# EasyEDA Pro project ProPrj_CyMouse.epro, schematic 无线充电接收端
Board Name: 无线充电接收端; Create Date: 2025-08-29; Page Name: P1; Project Name: CyMouse; Schematic Name: 无线充电接收端; Update Date: 2025-08-29; Company: 嘉立创EDA; Page Size: A4; Version: V1.0
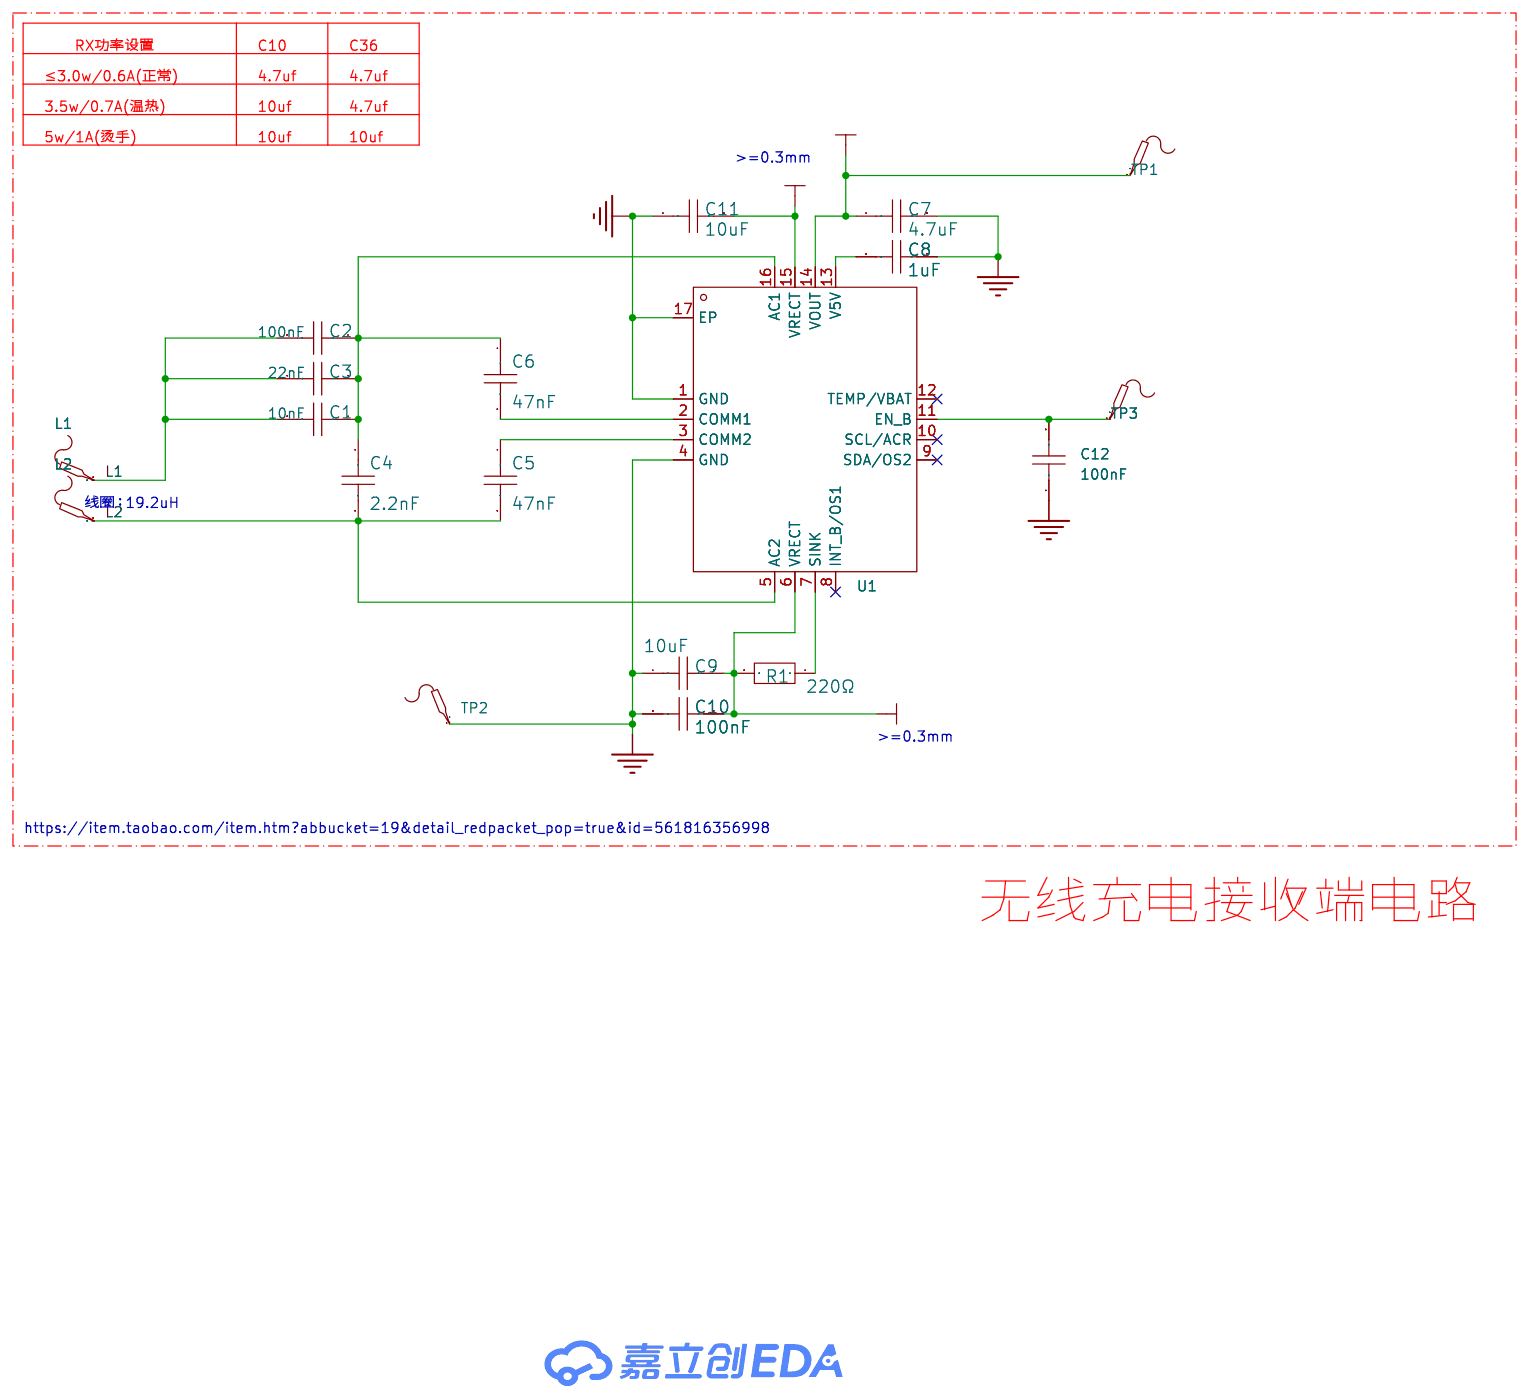
[diagram p2: schematic sheet]

## Parts
C1  10nF  [C0603]
C2  100nF  [C0603]
C3  22nF  [C0603]
C4  2.2nF  [C0603]
C5  47nF  [C0603]
C6  47nF  [C0603]
C7  4.7uF  [C0603]
C8  1uF  [C0603]
C9  10uF  [C0603]
C10  100nF  [C0603]
C11  10uF  [C0603]
C12  100nF  [C0603]
L1  -  [Test-Point-0.5mm]
L2  -  [Test-Point-0.5mm]
R1  220Ω  [R0603]
TP1  -  [Test-Point-0.5mm]
TP2  -  [Test-Point-0.5mm]
TP3  -  [Test-Point-0.5mm]
U1  NU1680  [QFN-16_L3.0-W3.0-P0.50-TL-EP1.9]

## Library data of the parts
C1 = CC0603KRX7R9BB103: 容值:10nF;精度:±10%;额定电压:50V;材质(温度系数):X7R;; LCSC Part Name: 10nF ±10% 50V; Supplier Part: C100042; Manufacturer: YAGEO(国巨); Supplier Footprint: 0603; JLCPCB Part Class: Extended Part; Datasheet: https://atta.szlcsc.com/upload/public/pdf/source/20181008/C309510_22F155564471FAF6A489F7D68F34234E.pdf; Supplier: LCSC; Tolerance: ±10%; Voltage Rated: 50V; Temperature Coefficient: X7R
C2 C10 C12 = CC0603JRX7R9BB104: 容值:100nF;精度:±5%;额定电压:50V;材质(温度系数):X7R;; LCSC Part Name: 100nF ±5% 50V; Supplier Part: C91183; Manufacturer: YAGEO(国巨); Supplier Footprint: 0603; JLCPCB Part Class: Extended Part; Datasheet: https://atta.szlcsc.com/upload/public/pdf/source/20170919/C131031_1505787245477976978.pdf; Supplier: LCSC; Tolerance: ±5%; Voltage Rated: 50V; Temperature Coefficient: X7R
C3 = CC0603JRX7R9BB223: 容值:22nF;精度:±5%;额定电压:50V;材质(温度系数):X7R;; LCSC Part Name: 22nF ±5% 50V; Supplier Part: C277528; Manufacturer: YAGEO(国巨); Supplier Footprint: 0603; JLCPCB Part Class: Extended Part; Datasheet: https://atta.szlcsc.com/upload/public/pdf/source/20181008/C309510_22F155564471FAF6A489F7D68F34234E.pdf; Supplier: LCSC; Tolerance: ±5%; Voltage Rated: 50V; Temperature Coefficient: X7R
C4 = CC0603JRNPO9BN222: 容值:2.2nF;精度:±5%;额定电压:50V;材质(温度系数):NP0;; LCSC Part Name: 2.2nF ±5% 50V; Supplier Part: C107043; Manufacturer: YAGEO(国巨); Supplier Footprint: 0603; JLCPCB Part Class: Extended Part; Datasheet: https://atta.szlcsc.com/upload/public/pdf/source/20170914/C128857_1505359892143968080.pdf; Supplier: LCSC; Tolerance: ±5%; Voltage Rated: 50V; Temperature Coefficient: NP0
C5 C6 = CC0603JRX7R9BB473: 容值:47nF;精度:±5%;额定电压:50V;材质(温度系数):X7R;; LCSC Part Name: 47nF ±5% 50V; Supplier Part: C519554; Manufacturer: YAGEO(国巨); Supplier Footprint: 0603; JLCPCB Part Class: Extended Part; Datasheet: https://atta.szlcsc.com/upload/public/pdf/source/20200423/C519554_A47B2077B76CCF5DDAED59412C429BD4.pdf; Supplier: LCSC; Tolerance: ±5%; Voltage Rated: 50V; Temperature Coefficient: X7R
C7 = CC0603KRX5R6BB475: 容值:4.7uF;精度:±10%;额定电压:10V;材质(温度系数):X5R;; LCSC Part Name: 4.7uF ±10% 10V; Supplier Part: C109456; Manufacturer: YAGEO(国巨); Supplier Footprint: 0603; JLCPCB Part Class: Extended Part; Datasheet: https://atta.szlcsc.com/upload/public/pdf/source/20180326/C109456_C871681ED5BBA6E2441ECA2A13136DA0.pdf; Supplier: LCSC; Tolerance: ±10%; Voltage Rated: 10V; Temperature Coefficient: X5R
C8 = CC0603JRX7R6BB105: 容值:1uF;精度:±5%;额定电压:10V;材质(温度系数):X7R;; LCSC Part Name: 1uF ±5% 10V; Supplier Part: C519559; Manufacturer: YAGEO(国巨); Supplier Footprint: 0603; JLCPCB Part Class: Extended Part; Datasheet: https://atta.szlcsc.com/upload/public/pdf/source/20200423/C519559_6C4B5FFAE74A7C54887BF5D296B4B550.pdf; Supplier: LCSC; Tolerance: ±5%; Voltage Rated: 10V; Temperature Coefficient: X7R
C9 C11 = CC0603KRX5R6BB106: 容值:10uF;精度:±10%;额定电压:10V;材质(温度系数):X5R;; LCSC Part Name: 10uF ±10% 10V; Supplier Part: C326057; Manufacturer: YAGEO(国巨); Supplier Footprint: 0603; JLCPCB Part Class: Extended Part; Datasheet: https://atta.szlcsc.com/upload/public/pdf/source/20181031/C326057_4190003E428C5A97DF6434D0EAB53BEA.pdf; Supplier: LCSC; Tolerance: ±10%; Voltage Rated: 10V; Temperature Coefficient: X5R
L1 L2 TP1-TP3 = Test-Point: Test Point 测试点
R1 = RC0603FR-07220RL: 电阻类型:厚膜电阻;阻值:220Ω;精度:±1%;功率:100mW;最大工作电压:75V;温度系数:±100ppm/℃;; LCSC Part Name: 厚膜电阻 220Ω ±1% 100mW; Supplier Part: C107696; Manufacturer: YAGEO(国巨); Supplier Footprint: 0603; JLCPCB Part Class: Extended Part; Datasheet: https://atta.szlcsc.com/upload/public/pdf/source/20180821/C275644_0D56F95EFF785E7D9A1FEF436B37DA78.pdf; Supplier: LCSC; Type: 厚膜电阻; Tolerance: ±1%; Power(Watts): 100mW; Overload Voltage (Max): 75V; Temperature Coefficient: ±100ppm/℃; Operating Temperature Range: -55℃~+155℃
U1 = NU1680: Supplier Part: C9900015597; Supplier Footprint: QFN-16; JLCPCB Part Class: 扩展库; Datasheet: https://atta.szlcsc.comnull; Supplier: LCSC

## Nets
GND: C7.2 C8.1 C9.1 C10.2 C11.1 C12.1 TP2.1 U1.1(GND) U1.4(GND) U1.17(EP)
L1: C1.2 C2.2 C3.2 L1.1
L2: C4.2 C5.2 L2.1 U1.5(AC2)
VRECT: C9.2 C10.1 C11.2 R1.2 U1.6(VRECT) U1.15(VRECT)
WC_OUT: C7.1 TP1.1 U1.14(VOUT)
$1N1006: C6.2 U1.2(COMM1)
$1N1007: C5.1 U1.3(COMM2)
$1N1010: C1.1 C2.1 C3.1 C4.1 C6.1 U1.16(AC1)
$1N1012: C8.2 U1.13(V5V)
$1N1018: R1.1 U1.7(SINK)
$1N1025: C12.2 TP3.1 U1.11(EN_B)

Not connected (* = marked no-connect by the designer): U1 8(INT_B/OS1)* 9(SDA/OS2)* 10(SCL/ACR)* 12(TEMP/VBAT)*

## Notes on the sheet
- RX功率设置
- C10
- C36
- ≤3.0w/0.6A(正常)
- 4.7uf
- 4.7uf
- 3.5w/0.7A(温热)
- 10uf
- 4.7uf
- 5w/1A(烫手)
- 10uf
- 10uf
- >=0.3mm
- 线圈：19.2uH
- >=0.3mm
- https://item.taobao.com/item.htm?abbucket=19&detail_redpacket_pop=true&id=561816356998
- 无线充电接收端电路
